# EAGLE design Papa_Soundie_doublesided (EAGLE 7.7.0)

## Sheet 1 of 2
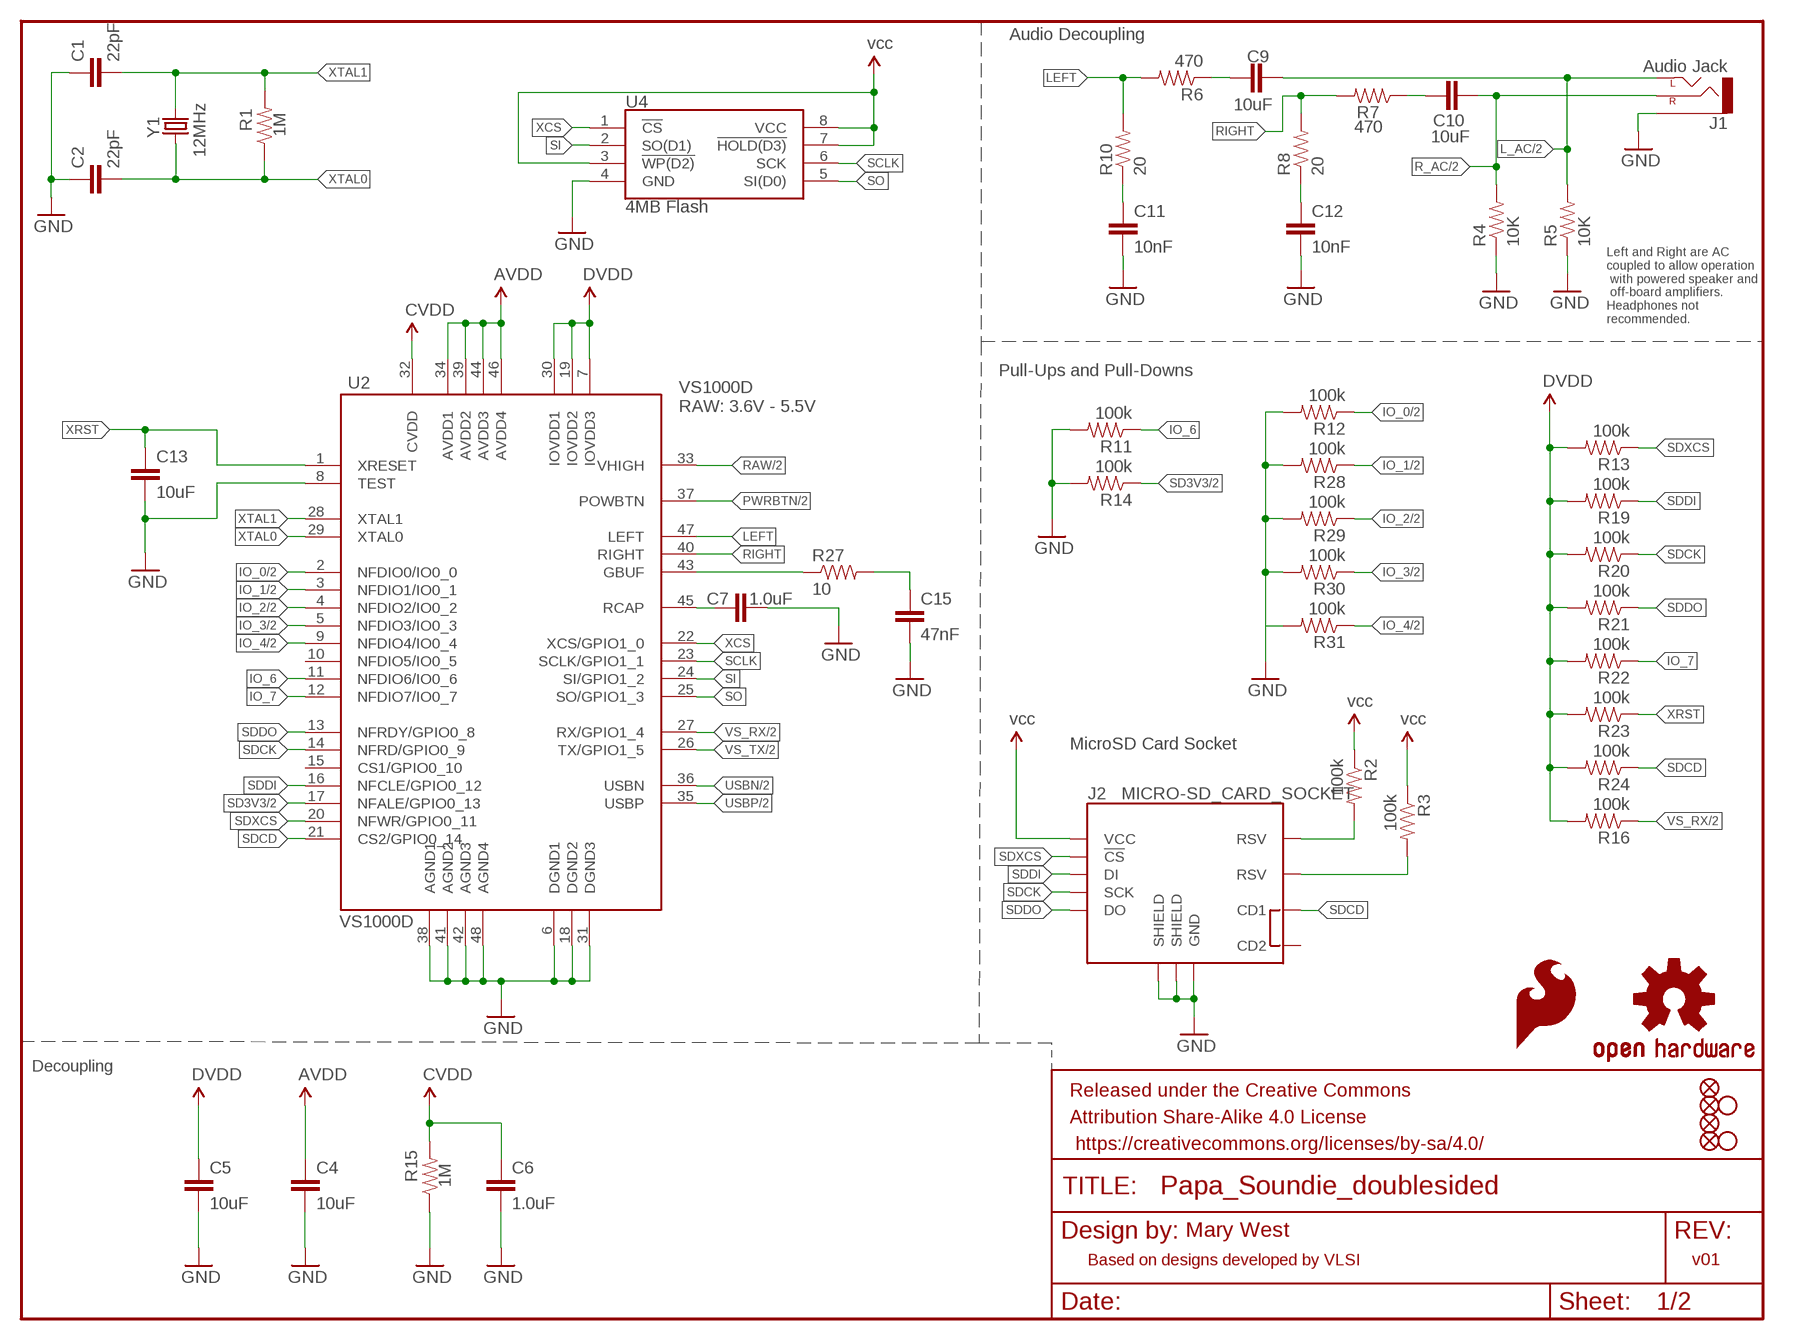
[diagram p0: schematic, sheet 1]

### Parts
C1  22pF  22PF-50V-5%(0603)  [0603-CAP]
C2  22pF  22PF-50V-5%(0603)  [0603-CAP]
C4  10uF  10UF-0603-6.3V-20%  [0603]
C5  10uF  10UF-0603-6.3V-20%  [0603]
C6  1.0uF  1.0UF-16V-10%(0603)  [0603-CAP]
C7  1.0uF  1.0UF-16V-10%(0603)  [0603-CAP]
C9  10uF  10UF-6.3V-20%(0603)  [0603-CAP]
C10  10uF  10UF-6.3V-20%(0603)  [0603-CAP]
C11  10nF  10NF/10000PF-50V-10%(0603)  [0603-CAP]
C12  10nF  10NF/10000PF-50V-10%(0603)  [0603-CAP]
C13  10uF  10UF-6.3V-20%(0603)  [0603-CAP]
C15  47nF  47NF(0.047UF/47000PF)-25V-5%(0603)SMD  [0603-CAP]
FD1  FIDUCIALUFIDUCIAL  [FIDUCIAL-MICRO]
FD2  FIDUCIALUFIDUCIAL  [FIDUCIAL-MICRO]
FD3  FIDUCIALUFIDUCIAL  [FIDUCIAL-MICRO]
FD4  FIDUCIALUFIDUCIAL  [FIDUCIAL-MICRO]
FRAME1  FRAME-LETTER  [CREATIVE_COMMONS]
H1  STAND-OFFTIGHT  [STAND-OFF-TIGHT]
H2  STAND-OFFTIGHT  [STAND-OFF-TIGHT]
J1  Audio Jack  AUDIO-JACKSMD2  [AUDIO-JACK-3.5MM-SMD]
J2  MICRO-SD_CARD_SOCKET  [MICRO-SD-SOCKET]
LOGO1  OSHW-LOGOL  [OSHW-LOGO-L]
LOGO2  SFE_LOGO_FLAME.2_INCH  [SFE_LOGO_FLAME_.2]
R1  1M  1MOHM-1/10W-1%(0603)  [0603-RES]
R2  100k  100KOHM-1/10W-1%(0603)  [0603-RES]
R3  100k  100KOHM-1/10W-1%(0603)  [0603-RES]
R4  10K  10KOHM-1/10W-1%(0603)0603  [0603-RES]
R5  10K  10KOHM-1/10W-1%(0603)0603  [0603-RES]
R6  470  470OHM1/10W1%(0603)  [0603-RES]
R7  470  470OHM1/10W1%(0603)  [0603-RES]
R8  20  20OHM1/10W1%(0603)SMD  [0603-RES]
R10  20  20OHM1/10W1%(0603)SMD  [0603-RES]
R11  100k  100KOHM-1/10W-1%(0603)  [0603-RES]
R12  100k  100KOHM-1/10W-1%(0603)  [0603-RES]
R13  100k  100KOHM-1/10W-1%(0603)  [0603-RES]
R14  100k  100KOHM-1/10W-1%(0603)  [0603-RES]
R15  1M  1MOHM-1/10W-1%(0603)  [0603-RES]
R16  100k  100KOHM-1/10W-1%(0603)  [0603-RES]
R19  100k  100KOHM-1/10W-1%(0603)  [0603-RES]
R20  100k  100KOHM-1/10W-1%(0603)  [0603-RES]
R21  100k  100KOHM-1/10W-1%(0603)  [0603-RES]
R22  100k  100KOHM-1/10W-1%(0603)  [0603-RES]
R23  100k  100KOHM-1/10W-1%(0603)  [0603-RES]
R24  100k  100KOHM-1/10W-1%(0603)  [0603-RES]
R27  10  10OHM-1/10W-5%0603SMD  [0603-RES]
R28  100k  100KOHM-1/10W-1%(0603)  [0603-RES]
R29  100k  100KOHM-1/10W-1%(0603)  [0603-RES]
R30  100k  100KOHM-1/10W-1%(0603)  [0603-RES]
R31  100k  100KOHM-1/10W-1%(0603)  [0603-RES]
U2  VS1000D  VS1000  [LQFP-48]
U4  4MB Flash  AT25SF041  [SO08]
Y1  12MHz  CRYSTALCRYSTAL-SMD-5X3-12MHZ  [CRYSTAL-SMD-5X3]

### Nets
AVDD: U2.34(AVDD1) U2.39(AVDD2) U2.44(AVDD3) U2.46(AVDD4)
CVDD: C6.1 R15.2 U2.32(CVDD)
DVDD: C5.1 R13.2 R16.2 R19.2 R20.2 R21.2 R22.2 R23.2 R24.2 U2.7(IOVDD3) U2.19(IOVDD2) U2.30(IOVDD1)
GBUF: R27.1 U2.43(GBUF)
GND: C1.1 C2.1 C4.2 C5.2 C6.2 C7.2 C11.2 C12.2 C13.2 C15.2 J1.SLEEVE J2.GND J2.GND1(SHIELD) J2.GND3(SHIELD) R4.1 R5.1 R11.2 R12.2 R14.2 R15.1 R28.2 R29.2 R30.2 R31.2 U2.6(DGND1) U2.8(TEST) U2.18(DGND2) U2.31(DGND3) U2.38(AGND1) U2.41(AGND2) U2.42(AGND3) U2.48(AGND4) U4.4(GND) ; also sheet 2
IO_0: R12.1 U2.2(NFDIO0/IO0_0) ; also sheet 2
IO_1: R28.1 U2.3(NFDIO1/IO0_1) ; also sheet 2
IO_2: R29.1 U2.4(NFDIO2/IO0_2) ; also sheet 2
IO_3: R30.1 U2.5(NFDIO3/IO0_3) ; also sheet 2
IO_4: R31.1 U2.9(NFDIO4/IO0_4) ; also sheet 2
IO_6: R11.1 U2.11(NFDIO6/IO0_6)
IO_7: R22.1 U2.12(NFDIO7/IO0_7)
L_AC: C9.2 J1.TIP(LEFT) R5.2 ; also sheet 2
LEFT: R6.2 R10.2 U2.47(LEFT)
N$2: C15.1 R27.2
N$3: C9.1 R6.1
N$6: C11.1 R10.1
N$7: C7.1 U2.45(RCAP)
N$15: J2.RSV1(RSV) R2.2
N$17: C10.1 R7.1
N$19: J2.RSV2(RSV) R3.2
N$20: C12.1 R8.1
PWRBTN: U2.37(POWBTN) ; also sheet 2
R_AC: C10.2 J1.RING(RIGHT) R4.2 ; also sheet 2
RAW: U2.33(VHIGH) ; also sheet 2
RIGHT: R7.2 R8.2 U2.40(RIGHT)
SCLK: U2.23(SCLK/GPIO1_1) U4.6(SCK)
SD3V3: R14.1 U2.17(NFALE/GPIO0_13) ; also sheet 2
SDCD: J2.CD1 R24.1 U2.21(CS2/GPIO0_14)
SDCK: J2.SCLK(SCK) R20.1 U2.14(NFRD/GPIO0_9)
SDDI: J2.DI R19.1 U2.16(NFCLE/GPIO0_12)
SDDO: J2.DO R21.1 U2.13(NFRDY/GPIO0_8)
SDXCS: J2.CS(!CS) R13.1 U2.20(NFWR/GPIO0_11)
SI: U2.24(SI/GPIO1_2) U4.2(SO(D1))
SO: U2.25(SO/GPIO1_3) U4.5(SI(D0))
USBN: U2.36(USBN) ; also sheet 2
USBP: U2.35(USBP) ; also sheet 2
VCC: C4.1 J2.VCC R2.1 R3.1 U4.3(!WP(D2)) U4.7(!HOLD(D3)) U4.8(VCC) ; supply symbol labelled vcc, AVDD ; also sheet 2
VS_RX: R16.1 U2.27(RX/GPIO1_4) ; also sheet 2
VS_TX: U2.26(TX/GPIO1_5) ; also sheet 2
XCS: U2.22(XCS/GPIO1_0) U4.1(!CS)
XRST: C13.1 R23.1 U2.1(XRESET)
XTAL0: C2.2 R1.1 U2.29(XTAL0) Y1.1
XTAL1: C1.2 R1.2 U2.28(XTAL1) Y1.3
Unconnected: J2.CD2 U2.10(NFDIO5/IO0_5) U2.15(CS1/GPIO0_10)

### Notes on the sheet
- Audio Decoupling
- Left and Right are AC
  coupled to allow operation
   with powered speaker and
   off-board amplifiers.
  Headphones not 
  recommended.
- Pull-Ups and Pull-Downs
- VS1000D 
  RAW: 3.6V - 5.5V
- MicroSD Card Socket
- Decoupling
- Mary West
- Based on designs developed by VLSI | v01

## Sheet 2 of 2
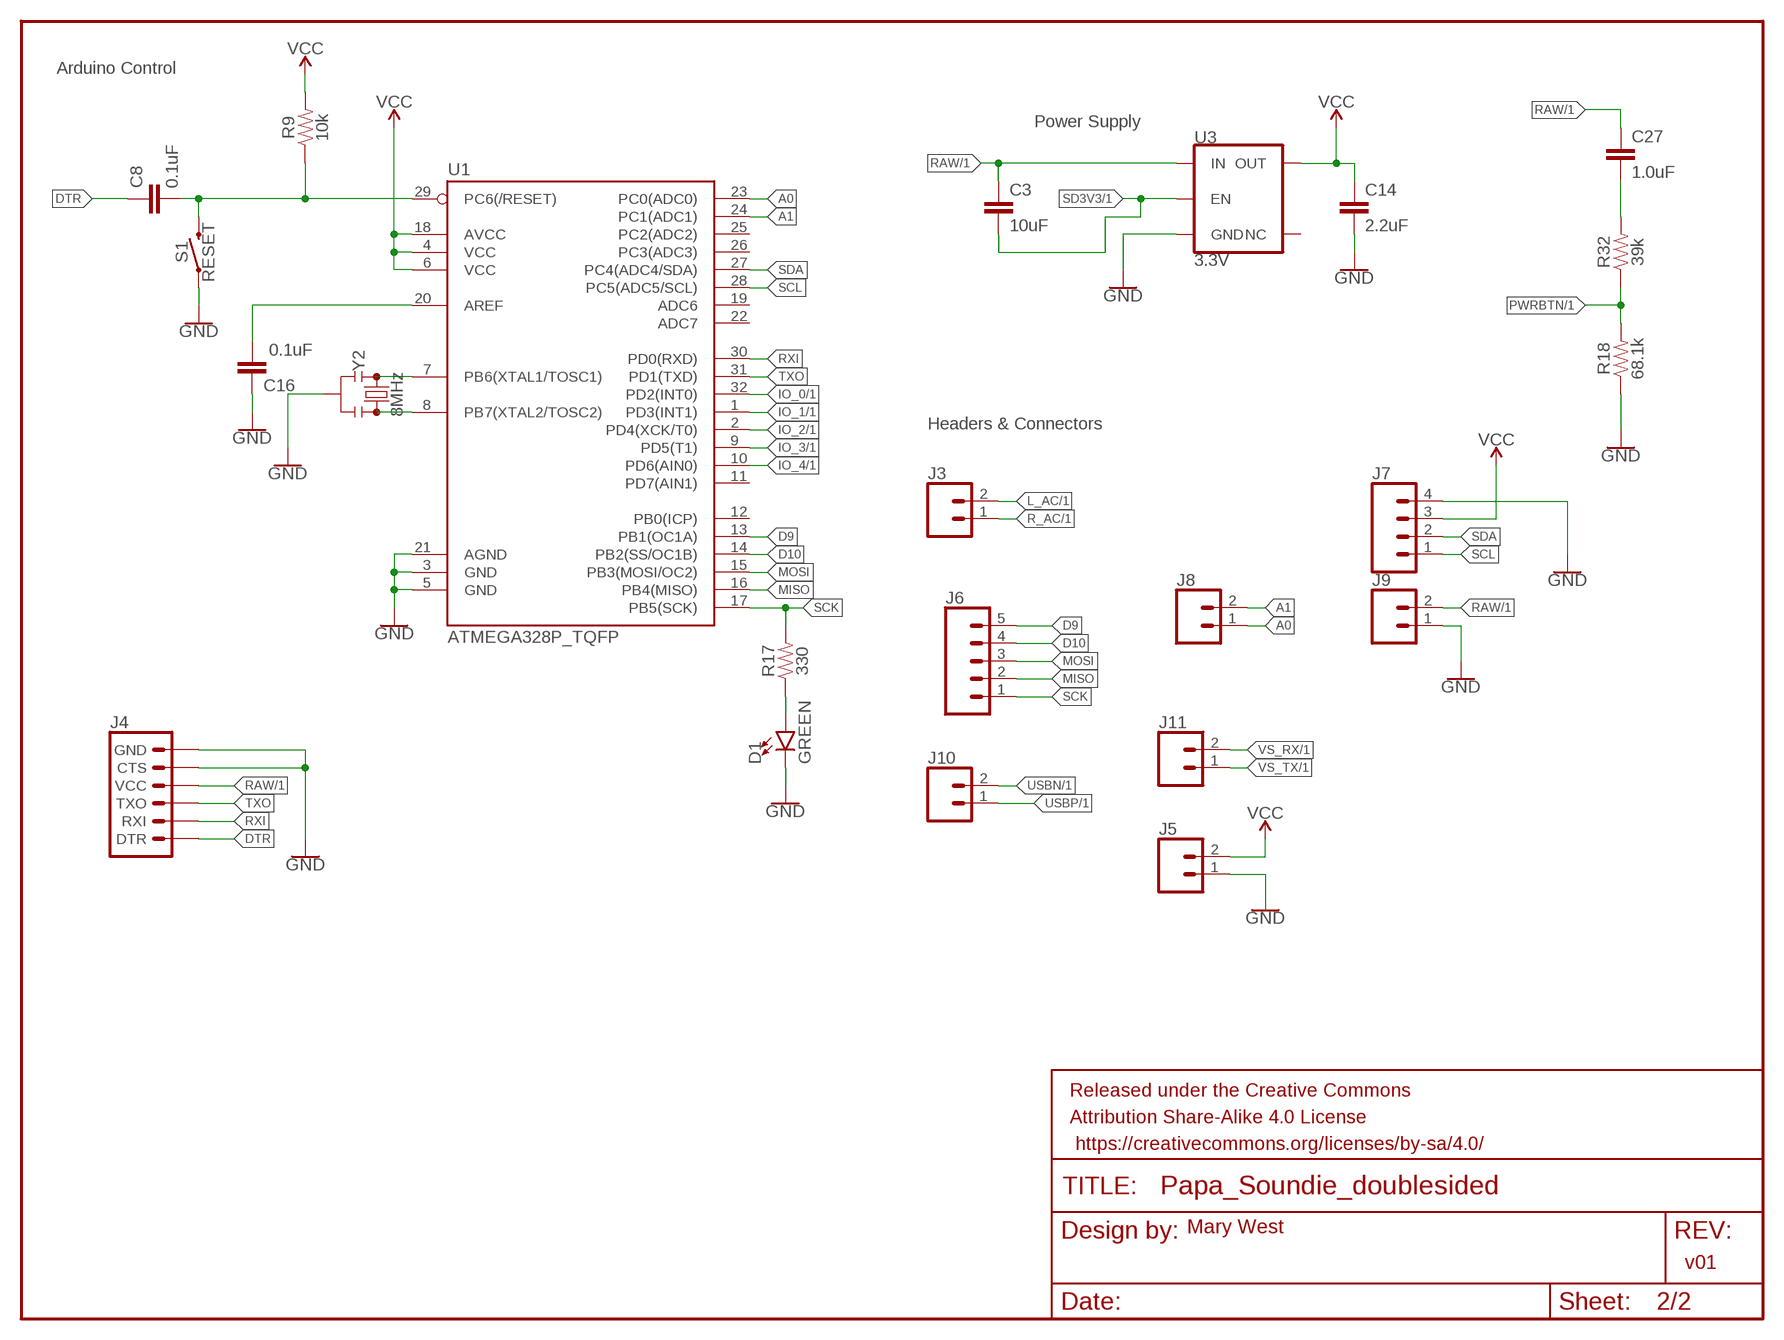
[diagram p1: schematic, sheet 2]

### Parts
C3  10uF  10UF-0603-6.3V-20%  [0603]
C8  0.1uF  0.1UF-0603-25V-(+80/-20%)  [0603]
C14  2.2uF  2.2UF-0603-10V-20%  [0603]
C16  0.1uF  0.1UF-0603-25V-(+80/-20%)  [0603]
C27  1.0uF  1.0UF-0603-16V-10%  [0603]
D1  GREEN  LED-GREEN0603  [LED-0603]
FRAME2  FRAME-LETTER  [CREATIVE_COMMONS]
J3  CONN_02  [1X02]
J4  6_PIN_SERIAL_TARGETSILK  [6_PIN_SERIAL_TARGET_SIDE_W_SILK]
J5  CONN_02  [1X02]
J6  CONN_05  [1X05]
J7  CONN_04  [1X04]
J8  CONN_02  [1X02]
J9  CONN_02  [1X02]
J10  CONN_02  [1X02]
J11  CONN_02  [1X02]
R9  10k  10KOHM-0603-1/10W-1%  [0603]
R17  330  330OHM-0603-1/10W-1%  [0603]
R18  68.1k  68.1KOHM-0603-1/10W-1%  [0603]
R32  39k  39KOHM-0603-1/10W-1%  [0603]
S1  RESET  MOMENTARY-SWITCH-SPST-SMD-5.2MM  [TACTILE_SWITCH_SMD_5.2MM]
U1  ATMEGA328P_TQFP  [TQFP32-08]
U3  3.3V  V_REG_AP2112K-3.3V  [SOT23-5]
Y2  8MHz  RESONATOR-8MHZSMD_3.2X1.3  [RESONATOR-SMD-3.2X1.3]

### Nets
A0: J8.1 U1.23(PC0(ADC0))
A1: J8.2 U1.24(PC1(ADC1))
D9: J6.5 U1.13(PB1(OC1A))
D10: J6.4 U1.14(PB2(SS/OC1B))
DTR: C8.1 J4.P$1(DTR)
GND: C14.2 C16.1 D1.C J4.P$5(CTS) J4.P$6(GND) J5.1 J7.4 J9.1 R18.1 S1.1 U1.3(GND) U1.5(GND) U1.21(AGND) U3.2(GND) Y2.2 ; also sheet 1
IO_0: U1.32(PD2(INT0)) ; also sheet 1
IO_1: U1.1(PD3(INT1)) ; also sheet 1
IO_2: U1.2(PD4(XCK/T0)) ; also sheet 1
IO_3: U1.9(PD5(T1)) ; also sheet 1
IO_4: U1.10(PD6(AIN0)) ; also sheet 1
L_AC: J3.2 ; also sheet 1
MISO: J6.2 U1.16(PB4(MISO))
MOSI: J6.3 U1.15(PB3(MOSI/OC2))
N$8: U1.7(PB6(XTAL1/TOSC1)) Y2.1
N$16: U1.8(PB7(XTAL2/TOSC2)) Y2.3
N$31: C8.2 R9.1 S1.3 U1.29(PC6(/RESET))
N$39: C16.2 U1.20(AREF)
N$42: D1.A R17.1
N$60: C27.2 R32.2
PWRBTN: R18.2 R32.1 ; also sheet 1
R_AC: J3.1 ; also sheet 1
RAW: C3.1 C27.1 J4.P$4(VCC) J9.2 U3.1(IN) ; also sheet 1
RXI: J4.P$3(RXI) U1.30(PD0(RXD))
SCK: J6.1 R17.2 U1.17(PB5(SCK))
SCL: J7.1 U1.28(PC5(ADC5/SCL))
SD3V3: C3.2 U3.3(EN) ; also sheet 1
SDA: J7.2 U1.27(PC4(ADC4/SDA))
TXO: J4.P$2(TXO) U1.31(PD1(TXD))
USBN: J10.2 ; also sheet 1
USBP: J10.1 ; also sheet 1
VCC: C14.1 J5.2 J7.3 R9.2 U1.4(VCC) U1.6(VCC) U1.18(AVCC) U3.5(OUT) ; also sheet 1
VS_RX: J11.2 ; also sheet 1
VS_TX: J11.1 ; also sheet 1
Unconnected: U1.11(PD7(AIN1)) U1.12(PB0(ICP)) U1.19(ADC6) U1.22(ADC7) U1.25(PC2(ADC2)) U1.26(PC3(ADC3)) U3.4(NC)

### Notes on the sheet
- Arduino Control
- Power Supply
- Headers & Connectors
- Mary West
- v01

## Library data of the parts
C1 C2 = SparkFun-Capacitors:22PF-50V-5%(0603): CAP-07876; PROD_ID: CAP-07876
C3-C5 = SparkFun-Capacitors:10UF: 10.0µF ceramic capacitors A capacitor is a passive two-terminal electrical component used to store electrical energy temporarily in an electric field.; PROD_ID: CAP-11015
C6 C7 = SparkFun-Capacitors:1.0UF-16V-10%(0603): CAP-00868; PROD_ID: CAP-00868
C8 C16 = SparkFun-Capacitors:0.1UF: 0.1µF ceramic capacitors A capacitor is a passive two-terminal electrical component used to store electrical energy temporarily in an electric field.; PROD_ID: CAP-00810
C9 C10 C13 = SparkFun-Capacitors:10UF-6.3V-20%(0603): CAP-11015; PROD_ID: CAP-11015
C11 C12 = SparkFun-Capacitors:10NF/10000PF-50V-10%(0603): CAP-00867; PROD_ID: CAP-00867
C14 = SparkFun-Capacitors:2.2UF: 2.2µF ceramic capacitors A capacitor is a passive two-terminal electrical component used to store electrical energy temporarily in an electric field.; PROD_ID: CAP-07888
C15 = SparkFun-Capacitors:47NF(0.047UF/47000PF)-25V-5%(0603): CAP-08605; PROD_ID: CAP-08605
C27 = SparkFun-Capacitors:1.0UF: 1µF ceramic capacitors A capacitor is a passive two-terminal electrical component used to store electrical energy temporarily in an electric field.; PROD_ID: CAP-00868
D1 = SparkFun-LED:LED-GREEN: Green SMD LED Used in manufacturing of various products at SparkFun Packages: 0603 - SMD 0603 package [Product Link] <http://www.futureelectronics.com/en/technologies/semiconductors/optoelectronics/leds/Pages/9894312-LTST-C190GKT.aspx?CrossPart=HSMG-C190&IM=0> LilyPad 1206 - SMD1206 LilyPad package [Product Link] <http://www.futureelectronics.com/en/Technologies/Product.aspx?ProductID=IN150NGHARVATEKCORPORATION2049943&IM=0> 1206 - SMD1206 package [Product Link] <http://www.futureelectronics.com/en/technologies/semiconductors/optoelectronics/leds/Pages/8315665-LTST-C150KGKT.aspx?IM=0> 1206 Bottom Mount -SMD 1206 Bottom Mount [Product Link] <http://www.digikey.com/product-detail/en/lite-on-inc/LTST-C230KGKT/160-1456-1-ND/386854> SparkFun Products: Pro Mini 328 -5V <https://www.sparkfun.com/products/821> RedBoard <https://www.sparkfun.com/products/12757> MP3 Trigger <https://www.sparkfun.com/products/13720> Makey Makey <https://www.sparkfun.com/products/11076>; PROD_ID: DIO-00821
FD1-FD4 = SparkFun-Aesthetics:FIDUCIAL: Fiducial Alignment Points Point-of-reference for pick-and-place machines and other optical instruments.
FRAME1 FRAME2 = SparkFun-Aesthetics:FRAME-LETTER: Schematic Frame - Letter Standard 8.5x11 US Letter frame
H1 H2 = SparkFun-Electromechanical:STAND-OFF: #4 Stand Off This is the mechanical footprint for a #4 phillips button head screw. Use the keepout ring to avoid running the screw head into surrounding components. SKU : PRT-00447
J1 = SparkFun-Connectors:AUDIO-JACK: 3.5mm Audio Jack Simple 3.5mm common PCB mount audio jack. Variant PTH is our storefront SKU PRT-08032; PROD_ID: CONN-10353
J2 = SparkFun-Connectors:MICRO-SD_CARD_SOCKET: microSD Socket for Transflash Push-push type µSD socket. tDoc lines correctly indicate media card edge positions when inserting (unlocked, locked, depressed). NOTE: CD1 and CD2 are connected internally, and the default detect state of the socket is detect pin to ground. SparkFun Products: WAV Trigger <https://www.sparkfun.com/products/13660> CAN-Bus Shield <https://www.sparkfun.com/products/13262> SparkFun Level Shifing microSD Breakout <https://www.sparkfun.com/products/13743>; PROD_ID: CONN-07820; SF_ID: PRT-00127
J3 J5 J8-J11 = SparkFun-Connectors:CONN_02: Multi connection point. Often used as Generic Header-pin footprint for 0.1 inch spaced/style header connections On any of the 0.1 inch spaced packages, you can populate with these: Break Away Headers - Straight <https://www.sparkfun.com/products/116> (PRT-00116) Break Away Male Headers - Right Angle <https://www.sparkfun.com/products/553> (PRT-00553) Female Headers <https://www.sparkfun.com/products/115> (PRT-00115) Break Away Headers - Machine Pin <https://www.sparkfun.com/products/117> (PRT-00117) Break Away Female Headers - Swiss Machine Pin <https://www.sparkfun.com/products/743> (PRT-00743) For SCREWTERMINALS and SPRING TERMINALS visit here: Screw Terimnals on SparkFun.com <https://www.sparkfun.com/search/results?term=Screw+Terminals> (5mm/3.5mm/2.54mm spacing) This device is also useful as a general connection point to wire up your design to another part of your project. Our various solder wires solder well into these plated through hole pads. Hook-Up Wire - Assortment (Stranded, 22 AWG) <https://www.sparkfun.com/products/11375> (PRT-11375) Hook-Up Wire - Assortment (Solid Core, 22 AWG) <https://www.sparkfun.com/products/11367> (PRT-11367) View the entire wire category on our website here <https://www.sparkfun.com/categories/141> Special notes: Molex polarized connector foot print use with: PRT-08233 with associated crimp pins and housings. 2.54_SCREWTERM for use with PRT-10571. 3.5mm Screw Terminal footprints for PRT-08084 5mm Screw Terminal footprints for use with PRT-08432
J4 = SparkFun-Connectors:6_PIN_SERIAL_TARGET: 6-pin header connection for use with the "FTDI BASIC" pinout - TARGET SIDE. Also known as "Arduino Serial Program Header". It is used to mate with our FTDI Basic serial programmers using the Arduino IDE. Note, this device has "TARGET" in the name. It is intended to be used on a design that contains a target micro-controller that you wish to program. The "sister" device, named "CABLE" is inteneded to be used on a design that usually lives on the end of your USB cable and prvides the converter chip (FTDI232 or FTDI231x) to commnicate serial RX/TX. You can populate with some of these: Break Away Headers - Straight <https://www.sparkfun.com/products/116> (PRT-00116) For reference (or to suit your programming needs) check out these designs: SparkFun FTDI Basic Breakout - 5V <https://www.sparkfun.com/products/9716> (DEV-09716) SparkFun FTDI Basic Breakout - 3.3V <https://www.sparkfun.com/products/9873> (DEV-09873) SparkFun FTDI SmartBasic <https://www.sparkfun.com/products/12935> (DEV-12935) SparkFun Beefy 3 - FTDI Basic Breakout <https://www.sparkfun.com/products/13746> (DEV-13746)
J6 = SparkFun-Connectors:CONN_05: Multi connection point. Often used as Generic Header-pin footprint for 0.1 inch spaced/style header connections On any of the 0.1 inch spaced packages, you can populate with these: Break Away Headers - Straight <https://www.sparkfun.com/products/116> (PRT-00116) Break Away Male Headers - Right Angle <https://www.sparkfun.com/products/553> (PRT-00553) Female Headers <https://www.sparkfun.com/products/115> (PRT-00115) Break Away Headers - Machine Pin <https://www.sparkfun.com/products/117> (PRT-00117) Break Away Female Headers - Swiss Machine Pin <https://www.sparkfun.com/products/743> (PRT-00743) For SCREWTERMINALS and SPRING TERMINALS visit here: Screw Terimnals on SparkFun.com <https://www.sparkfun.com/search/results?term=Screw+Terminals> (5mm/3.5mm/2.54mm spacing) This device is also useful as a general connection point to wire up your design to another part of your project. Our various solder wires solder well into these plated through hole pads. Hook-Up Wire - Assortment (Stranded, 22 AWG) <https://www.sparkfun.com/products/11375> (PRT-11375) Hook-Up Wire - Assortment (Solid Core, 22 AWG) <https://www.sparkfun.com/products/11367> (PRT-11367) View the entire wire category on our website here <https://www.sparkfun.com/categories/141> Special notes: Molex polarized connector foot print use with SKU : PRT-08231 with associated crimp pins and housings. 1MM SMD Version SKU: PRT-10208
J7 = SparkFun-Connectors:CONN_04: Multi connection point. Often used as Generic Header-pin footprint for 0.1 inch spaced/style header connections On any of the 0.1 inch spaced packages, you can populate with these: Break Away Headers - Straight <https://www.sparkfun.com/products/116> (PRT-00116) Break Away Male Headers - Right Angle <https://www.sparkfun.com/products/553> (PRT-00553) Female Headers <https://www.sparkfun.com/products/115> (PRT-00115) Break Away Headers - Machine Pin <https://www.sparkfun.com/products/117> (PRT-00117) Break Away Female Headers - Swiss Machine Pin <https://www.sparkfun.com/products/743> (PRT-00743) For SCREWTERMINALS and SPRING TERMINALS visit here: Screw Terimnals on SparkFun.com <https://www.sparkfun.com/search/results?term=Screw+Terminals> (5mm/3.5mm/2.54mm spacing) This device is also useful as a general connection point to wire up your design to another part of your project. Our various solder wires solder well into these plated through hole pads. Hook-Up Wire - Assortment (Stranded, 22 AWG) <https://www.sparkfun.com/products/11375> (PRT-11375) Hook-Up Wire - Assortment (Solid Core, 22 AWG) <https://www.sparkfun.com/products/11367> (PRT-11367) View the entire wire category on our website here <https://www.sparkfun.com/categories/141> Special notes: Molex polarized connector foot print use with SKU : PRT-08231 with associated crimp pins and housings. 1MM SMD Version SKU: PRT-10208; PROD_ID: CONN-09696
LOGO1 = SparkFun-Aesthetics:OSHW-LOGO: Open-Source Hardware (OSHW) Logo This logo indicates the piece of hardware it is found on incorporates a OSHW license and/or adheres to the definition of open source hardware found here: http://freedomdefined.org/OSHW
LOGO2 = SparkFun-Aesthetics:SFE_LOGO_FLAME: SparkFun Flame Logo This is the SparkFun flame logo. The logo on the schematic will always be the same size; the package variant is the height of the flame. Default layer for the logo on the board is tSilk.
R1 R15 = SparkFun-Resistors:1MOHM-1/10W-1%(0603): RES-07868; PROD_ID: RES-07868
R2 R3 R11-R14 R16 R19-R24 R28-R31 = SparkFun-Resistors:100KOHM-1/10W-1%(0603): RES-07828; PROD_ID: RES-07828
R4 R5 = SparkFun-Resistors:10KOHM-1/10W-1%(0603): RES-00824; PROD_ID: RES-00824
R6 R7 = SparkFun-Resistors:470OHM1/10W1%(0603): RES-07869; PROD_ID: RES-07869
R8 R10 = SparkFun-Resistors:20OHM1/10W1%(0603): RES-07862; PROD_ID: RES-07862
R9 = SparkFun-Resistors:10KOHM: 10kΩ resistor A resistor is a passive two-terminal electrical component that implements electrical resistance as a circuit element. Resistors act to reduce current flow, and, at the same time, act to lower voltage levels within circuits. - Wikipedia; PROD_ID: RES-00824
R17 = SparkFun-Resistors:330OHM: 330Ω resistor A resistor is a passive two-terminal electrical component that implements electrical resistance as a circuit element. Resistors act to reduce current flow, and, at the same time, act to lower voltage levels within circuits. - Wikipedia; PROD_ID: RES-00818
R18 = SparkFun-Resistors:68.1KOHM: 68.1kΩ resistor A resistor is a passive two-terminal electrical component that implements electrical resistance as a circuit element. Resistors act to reduce current flow, and, at the same time, act to lower voltage levels within circuits. - Wikipedia; PROD_ID: RES-09380
R27 = SparkFun-Resistors:10OHM-1/10W-5%0603: RES-09834; PROD_ID: RES-09834
R32 = SparkFun-Resistors:39KOHM: 39kΩ resistor A resistor is a passive two-terminal electrical component that implements electrical resistance as a circuit element. Resistors act to reduce current flow, and, at the same time, act to lower voltage levels within circuits. - Wikipedia; PROD_ID: RES-12377
S1 = SparkFun-Switches:MOMENTARY-SWITCH-SPST: Momentary Switch (Pushbutton) - SPST Normally-open (NO) SPST momentary switches (buttons, pushbuttons). Variants PTH-12MM - 12mm square, through-hole Momentary Pushbutton Switch - 12mm Square <https://www.sparkfun.com/products/9190> (COM-09190) PTH-6.0MM, PTH-6.0MM-KIT - 6.0mm square, through-hole Mini Pushbutton Switch <https://www.sparkfun.com/products/97> (COM-00097) KIT package intended for soldering kit's - only one side of pads' copper is exposed. PTH-RIGHT-ANGLE-KIT - Right-angle, through-hole Right Angle Tactile Button <https://www.sparkfun.com/products/10791> - Used on SparkFun BigTime Watch Kit <https://www.sparkfun.com/products/11734> SMD-12MM - 12mm square, surface-mount Tactile Button - SMD (12mm) <https://www.sparkfun.com/products/12993> (COM-12993) Used on SparkFun PicoBoard <https://www.sparkfun.com/products/11888> SMD-4.5MM - 4.5mm Square Trackball Switch Used on SparkFun Blackberry Trackballer Breakout <https://www.sparkfun.com/products/13169> SMD-4.6MMX2.8MM - 4.60mm x 2.80mm, surface mount Used on SparkFun SAMD21 Mini Breakout <https://www.sparkfun.com/products/13664> SMD-5.2MM, SMD-5.2-REDUNDANT - 5.2mm square, surface-mount Mini Pushbutton Switch - SMD <https://www.sparkfun.com/products/8720> (COM-08720) Used on Arduino Pro Mini <https://www.sparkfun.com/products/11114> REDUNDANT package connects both switch circuits together SMD-6.0X3.5MM - 6.0 x 3.5mm, surface mount Momentary Reset Switch SMD <https://www.sparkfun.com/products/8229> (COM-08229) SMD-6.2MM-TALL - 6.2mm square, surface mount Tactile Button - SMD (6mm) <https://www.sparkfun.com/products/12992> Used on SparkFun Digital Sandbox <https://www.sparkfun.com/products/12651> SMD-RIGHT-ANGLE - Right-angle, surface mount Used on SparkFun Block for Intel® Edison - Arduino <https://www.sparkfun.com/products/13036>; PROD_ID: SWCH-08247; SF_SKU: COM-08720
U1 = SparkFun-IC-Microcontroller:ATMEGA328P_TQFP: Popular 328P in QFP Storefront component: ATmega328 - TQFP <https://www.sparkfun.com/products/13448> (COM-13448) Datasheet <http://www.sparkfun.com/datasheets/Components/SMD/ATMega328.pdf> SparkFun Products SparkFun RedBoard - Programmed with Arduino <https://www.sparkfun.com/products/12757> (DEV-12757) Arduino Pro Mini 328 - 5V/16MHz <https://www.sparkfun.com/products/11113> (DEV-11113) Arduino Pro Mini 328 - 3.3V/8MHz <https://www.sparkfun.com/products/11114> (DEV-11114) SparkFun OpenLog <https://www.sparkfun.com/products/13712> (DEV-13712) SparkFun MicroView - OLED Arduino Module <https://www.sparkfun.com/products/12923> (DEV-12923) SparkFun Digital Sandbox <https://www.sparkfun.com/products/12651> (DEV-12651) SparkFun PicoBoard <https://www.sparkfun.com/products/11888> (WIG-11888) Arduino Fio <https://www.sparkfun.com/products/10116> (DEV-10116) LilyPad Arduino 328 Main Board <https://www.sparkfun.com/products/13342> (DEV-13342) SparkFun RedStick <https://www.sparkfun.com/products/13741> (DEV-13741) LilyPad MP3 <https://www.sparkfun.com/products/11013> (DEV-11013) LilyPad Arduino SimpleSnap <https://www.sparkfun.com/products/10941> (DEV-10941) SparkFun Stepoko <https://www.sparkfun.com/products/13899> (ROB-13899) SparkFun Geiger Counter <https://www.sparkfun.com/products/11345> (SEN-11345) SparkFun EL Sequencer <https://www.sparkfun.com/products/12781> (COM-12781) Arduino Pro 328 - 5V/16MHz <https://www.sparkfun.com/products/10915> (DEV-10915) CryptoCape <https://www.sparkfun.com/products/12773> (DEV-12773) SparkFun IR Thermometer Evaluation Board - MLX90614 <https://www.sparkfun.com/products/10740> (SEN-10740) SparkFun RedBot Mainboard <https://www.sparkfun.com/products/12097> (ROB-12097) Arduino Pro 328 - 3.3V/8MHz <https://www.sparkfun.com/products/10914> (DEV-10914) SparkFun Block for Intel® Edison - Arduino <https://www.sparkfun.com/products/13036> (DEV-13036) SparkFun Simon Says - Surface Mount Soldering Kit <https://www.sparkfun.com/products/10935> (KIT-10935) SparkFun 7-Segment Serial Display - Red <https://www.sparkfun.com/products/11441> (COM-11441) SparkFun 7-Segment Serial Display - White <https://www.sparkfun.com/products/11629> (COM-11629) SparkFun 7-Segment Serial Display - Yellow <https://www.sparkfun.com/products/11443> (COM-11443) SparkFun 7-Segment Serial Display - Kelly Green <https://www.sparkfun.com/products/11440> (COM-11440) SparkFun 7-Segment Serial Display - Blue <https://www.sparkfun.com/products/11442> (COM-11442) SparkFun OpenSegment Serial Display - 20mm (Blue) <https://www.sparkfun.com/products/11647> (COM-11647) SparkFun OpenSegment Serial Display - 20mm (Green) <https://www.sparkfun.com/products/11646> (COM-11646) SparkFun OpenSegment Serial Display - 20mm (White) <https://www.sparkfun.com/products/11648> (COM-11648) SparkFun OpenSegment Serial Display - 20mm (Red) <https://www.sparkfun.com/products/11644> (COM-11644) SparkFun OpenSegment Serial Display - 20mm (Yellow) <https://www.sparkfun.com/products/11645> (COM-11645) SparkFun OpenSegment Shield <https://www.sparkfun.com/products/13190> (DEV-13190); PROD_ID: IC-09069
U2 = SparkFun-IC-Conversion:VS1000: VS1000D Ogg Vorbis Player IC with USB and NAND FLASH Interface 12 MHz LQFP-48 Datasheet SparkFun Products Storefront component: Ogg Vorbis Codec IC - VS1000D <https://www.sparkfun.com/products/8300> (COM-08300); PROD_ID: LPA-12743
U3 = SparkFun-IC-Power:V_REG_AP2112: AP2112 - 600mA CMOS LDO Regulator w/ Enable The AP2112 is CMOS process low dropout linear regulator with enable function, the regulator delivers a guaranteed 600mA (min.) continuous load current. Features Output Voltage Accuracy: ±1.5% Output Current: 600mA (Min.) Foldback Short Current Protection: 50mA Enable Function to Turn ON/OFF VOUT Low Dropout Voltage (3.3V): 250mV (Typ.) @IOUT=600mA Excellent Load Regulation: 0.2%/A (Typ.) Excellent Line Regulation: 0.02%/V (Typ.) Low Quiescent Current: 55μA (Typ.) Low Standby Current: 0.01μA (Typ.) Low Output Noise: 50μVRMS PSRR: 100Hz -65dB, 1kHz -65dB OTSD Protection Stable with 1.0μF Flexible Cap: Ceramic, Tantalum and Aluminum Electrolytic Operation Temperature Range: -40°C to 85°C ESD: MM 400V, HBM 4000V; PROD_ID: VREG-12457
U4 = SparkFun-IC-Memory:AT25SF041: AT25SF041 4Mb Serial Flash Memory 104MHz, SPI, 8-SOIC Datasheet <http://www.adestotech.com/wp-content/uploads/DS-AT25SF041_044.pdf> SparkFun Products: SparkFun ESP8266 Thing <https://www.sparkfun.com/products/13231> SparkFun ESP8266 Thing - Dev Board <https://www.sparkfun.com/products/13711>; PROD_ID: IC-12455
Y1 = SparkFun-FreqCtrl:CRYSTAL: Various standard crystals. Proven footprints.; PROD_ID: XTAL-08297
Y2 = SparkFun-Clocks:RESONATOR-8MHZ: 8MHz Resonator Digikey Example <http://www.digikey.com/product-detail/en/murata-electronics-north-america/CSTCE10M0G55-R0/490-1196-1-ND/584633> Frequency: 8MHz Frequency Stability: ±0.2% Frequency Tolerance: ±0.5% Capacitance: 33pF SparkFun Products Arduino Pro Mini 328- 3.3V/8MHz <https://www.sparkfun.com/products/11114> SparkFun Digital Sandbox <https://www.sparkfun.com/products/12651>; PROD_ID: XTAL-08895

## Board
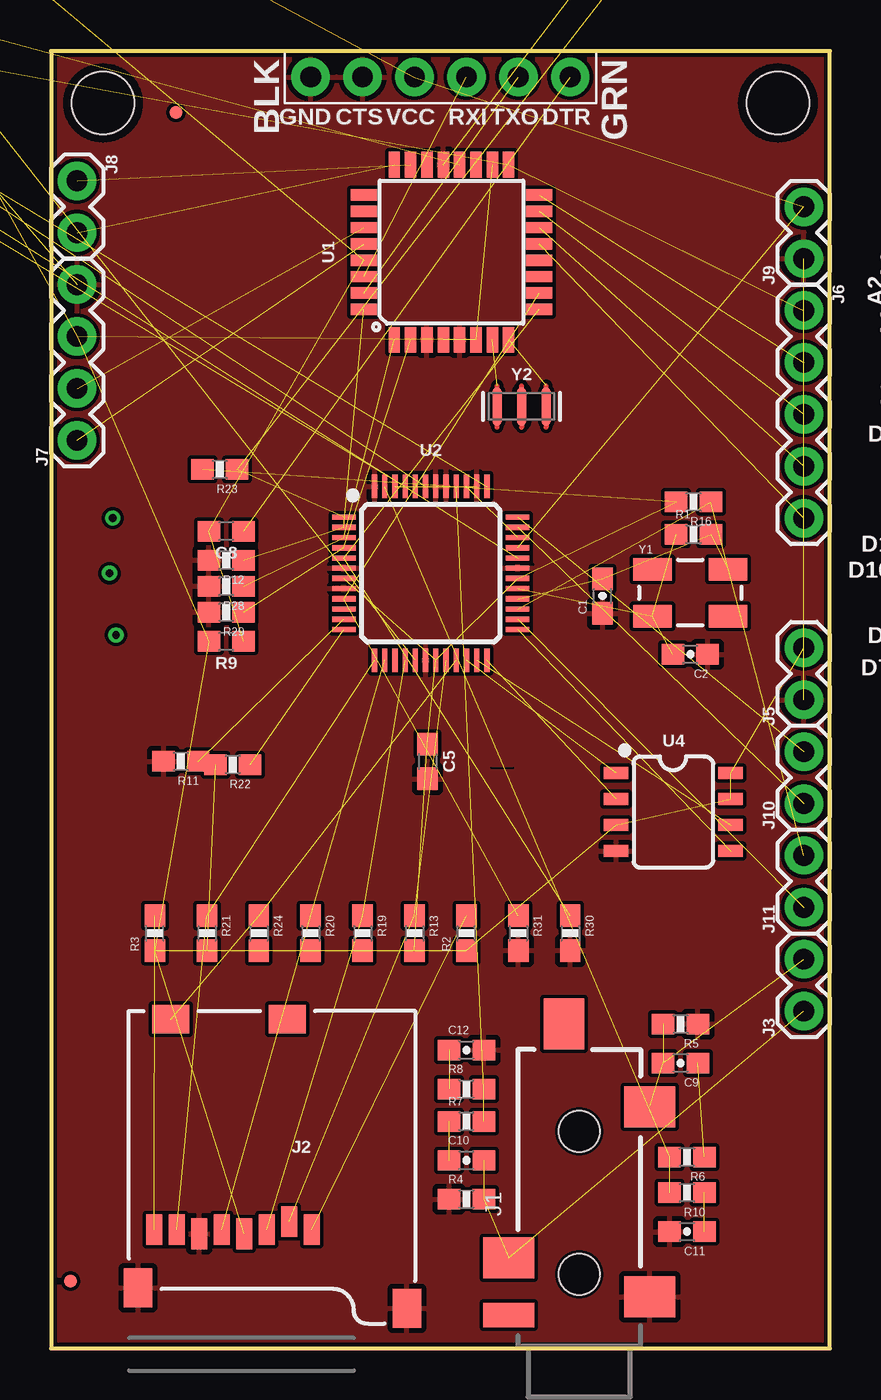
[diagram p2: board, top side]
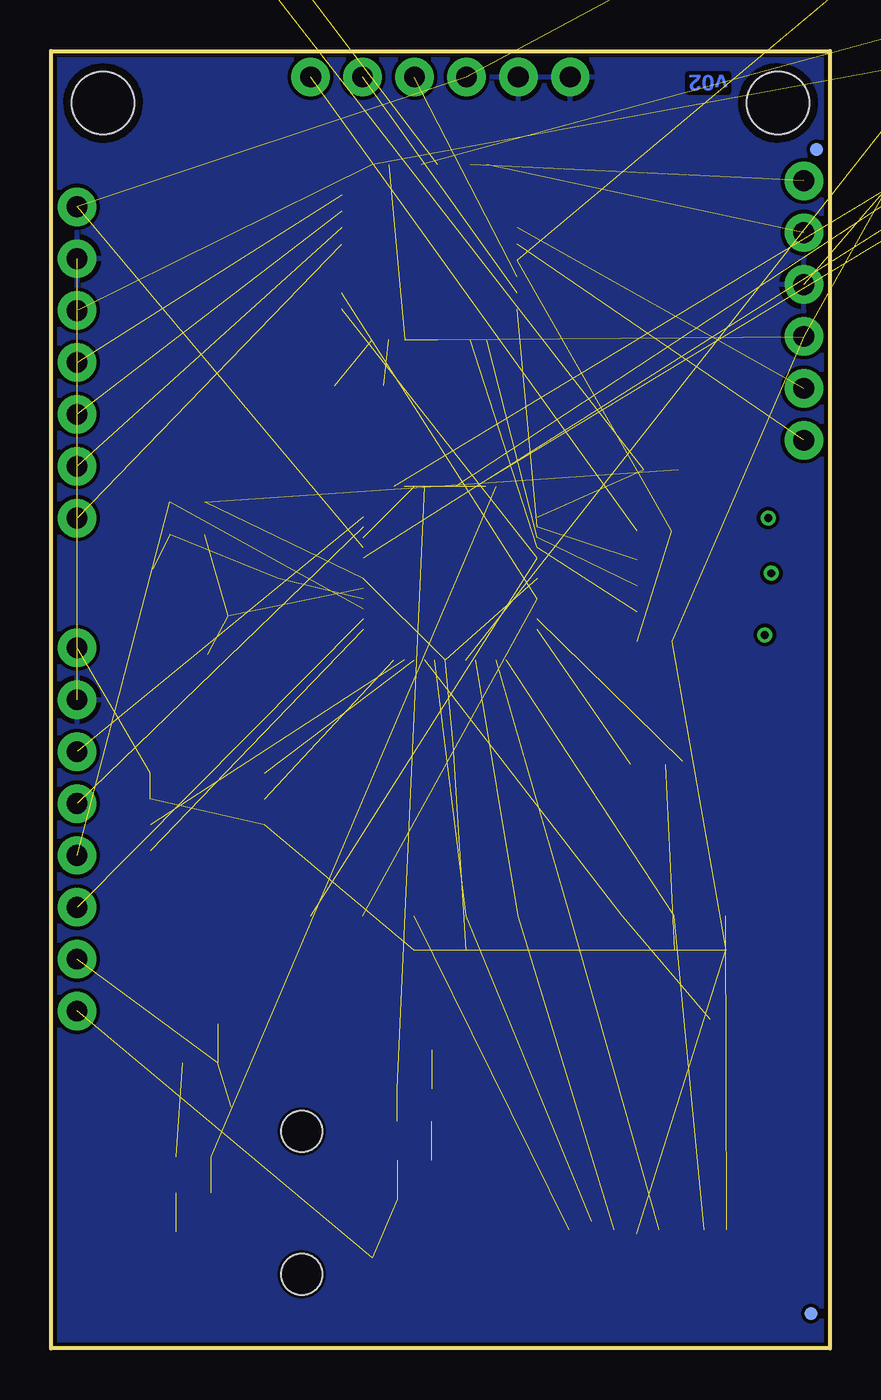
[diagram p3: board, bottom side, seen from below]

Size 38.1 x 63.5 mm. Coordinates in mm from the lower left corner, seen from the top.
Outline: 38.1,63.5 0,63.5 0,0 38.1,0 38.1,63.5
Copper layers (1*16): Top 0.035mm / dielectric 1.5mm / Bottom 0.035mm
Design rules "SparkFun-2-layer-TIGHT": minimum track width 7mil, minimum drill 15mil, track to track 7mil, track to pad 7mil, pad to pad 7mil, via to via 7mil, smd to smd 7mil, copper to edge 7mil, drill to drill 7mil, minimum pad ring 7mil, minimum via ring 7mil, stop-mask expansion 4mil, vias tented up to drill 25mil, thermal gap 10mil
tRestrict: 1 lines

### Footprints (pad centres in the part's own frame; a part is rotated, then mirrored left to right if it is on the bottom)
0603-CAP = smd 1.1 x 1: 1 -0.85,0; 2 0.85,0
0603 = smd 1.1 x 1: 1 -0.85,0; 2 0.85,0
LED-0603 = smd 1 x 1: A -0.877,0; C 0.877,0
FIDUCIAL-MICRO = smd 0.635 x 0.635: 1 0,0
STAND-OFF-TIGHT = hole 3.048: 0,0
AUDIO-JACK-3.5MM-SMD = smd 2 x 2.5: RING 4.3,3.45; SLEEVE 2.4,-3.45; TIP 11.7,-3.45 | smd 1.2 x 2.5: RSH 1.5,3.45 | smd 2.5 x 2: TSH 15.75,0.75 | hole 2: 3.5,0; 10.5,0
MICRO-SD-SOCKET = smd 1.8 x 1.4: CD1 -2.05,0.4; CD2 -7.75,0.4 | smd 0.8 x 1.5: CS -7.84,10.3; DI -6.74,10.7; DO -2.34,10.7; GND -3.44,10.9; RSV1 -8.94,10.7; RSV2 -1.24,10.7; SCLK -4.54,10.7; VCC -5.64,10.9 | smd 1.4 x 1.9: GND1 -13.6,14.55; GND3 -0.45,13.55
1X02 = drill 1.016 pad 1.88: 1 0,0; 2 2.54,0
6_PIN_SERIAL_TARGET_SIDE_W_SILK = drill 1.016 pad 1.88: P$1 -6.35,0; P$2 -3.81,0; P$3 -1.27,0; P$4 1.27,0; P$5 3.81,0; P$6 6.35,0
1X05 = drill 1.016 pad 1.88: 1 0,0; 2 2.54,0; 3 5.08,0; 4 7.62,0; 5 10.16,0
1X04 = drill 1.016 pad 1.88: 1 0,0; 2 2.54,0; 3 5.08,0; 4 7.62,0
0603-RES = smd 1.1 x 1: 1 -0.85,0; 2 0.85,0
TACTILE_SWITCH_SMD_5.2MM = smd 1.524 x 0.762: 1 -2.794,1.905; 2 2.794,1.905; 3 -2.794,-1.905; 4 2.794,-1.905
TQFP32-08 = smd 1.27 x 0.559: 1 -4.293,2.8; 2 -4.293,2; 3 -4.293,1.2; 4 -4.293,0.4; 5 -4.293,-0.4; 6 -4.293,-1.2; 7 -4.293,-2; 8 -4.293,-2.8; 17 4.293,-2.8; 18 4.293,-2; 19 4.293,-1.2; 20 4.293,-0.4; 21 4.293,0.4; 22 4.293,1.2; 23 4.293,2; 24 4.293,2.8 | smd 0.559 x 1.27: 9 -2.8,-4.293; 10 -2,-4.293; 11 -1.2,-4.293; 12 -0.4,-4.293; 13 0.4,-4.293; 14 1.2,-4.293; 15 2,-4.293; 16 2.8,-4.293; 25 2.8,4.293; 26 2,4.293; 27 1.2,4.293; 28 0.4,4.293; 29 -0.4,4.293; 30 -1.2,4.293; 31 -2,4.293; 32 -2.8,4.293
LQFP-48 = smd 0.254 x 1.143: 1 -2.75,-4.25; 2 -2.25,-4.25; 3 -1.75,-4.25; 4 -1.25,-4.25; 5 -0.75,-4.25; 6 -0.25,-4.25; 7 0.25,-4.25; 8 0.75,-4.25; 9 1.25,-4.25; 10 1.75,-4.25; 11 2.25,-4.25; 12 2.75,-4.25; 25 2.75,4.25; 26 2.25,4.25; 27 1.75,4.25; 28 1.25,4.25; 29 0.75,4.25; 30 0.25,4.25; 31 -0.25,4.25; 32 -0.75,4.25; 33 -1.25,4.25; 34 -1.75,4.25; 35 -2.25,4.25; 36 -2.75,4.25 | smd 1.143 x 0.254: 13 4.25,-2.75; 14 4.25,-2.25; 15 4.25,-1.75; 16 4.25,-1.25; 17 4.25,-0.75; 18 4.25,-0.25; 19 4.25,0.25; 20 4.25,0.75; 21 4.25,1.25; 22 4.25,1.75; 23 4.25,2.25; 24 4.25,2.75; 37 -4.25,2.75; 38 -4.25,2.25; 39 -4.25,1.75; 40 -4.25,1.25; 41 -4.25,0.75; 42 -4.25,0.25; 43 -4.25,-0.25; 44 -4.25,-0.75; 45 -4.25,-1.25; 46 -4.25,-1.75; 47 -4.25,-2.25; 48 -4.25,-2.75
SOT23-5 = smd 0.55 x 1.2: 1 -0.95,-1.3; 2 0,-1.3; 3 0.95,-1.3; 4 0.95,1.3; 5 -0.95,1.3
SO08 = smd 0.6 x 1.2: 1 -1.905,-2.8; 2 -0.635,-2.8; 3 0.635,-2.8; 4 1.905,-2.8; 5 1.905,2.8; 6 0.635,2.8; 7 -0.635,2.8; 8 -1.905,2.8
CRYSTAL-SMD-5X3 = smd 1.9 x 1.1: 1 -1.85,-1.15; 2 1.85,-1.15; 3 1.85,1.15; 4 -1.85,1.15
RESONATOR-SMD-3.2X1.3 = smd 0.45 x 1.905: 1 -1.2,0; 2 0,0; 3 1.2,0

### Placement (x,y rotation side)
C1  26.99,36.83 90 top
C2  31.27,33.97 180 top
C3  -23.65,78.11 90 top  (outside the outline)
C4  -12.22,72.87 270 top  (outside the outline)
C5  18.41,28.73 270 top
C6  -11.75,61.12 0 top  (outside the outline)
C7  -25.4,68.9 90 top  (outside the outline)
C8  8.57,40.01 180 top
C9  30.8,13.97 180 top
C10  20.32,9.21 0 top
C11  31.11,5.71 180 top
C12  20.32,14.61 0 top
C13  28.57,69.22 180 top  (outside the outline)
C14  -16.03,72.87 270 top  (outside the outline)
C15  -23.02,68.9 270 top  (outside the outline)
C16  -6.03,65.25 180 top  (outside the outline)
C27  -13.34,78.11 270 top  (outside the outline)
D1  -6.03,61.59 180 top  (outside the outline)
FD1  6.11,60.49 90 top
FD2  0.95,3.3 90 top
FD3  0.65,58.69 180 bottom
FD4  0.92,1.71 180 bottom
FRAME1  -15.08,-23.81 0 top  (outside the outline)
FRAME2  -15.08,-23.81 0 top  (outside the outline)
FRAME3  FRAME-LETTER  [CREATIVE_COMMONS]  -15.08,-23.81 0 top  (outside the outline)
H1  35.56,60.96 90 top
H2  2.54,60.96 180 top
J1  25.84,0.13 90 top
J2  3.81,16.51 180 top
J3  36.83,16.51 90 top
J4  19.05,62.23 180 top
J5  36.83,31.75 90 top
J6  36.83,50.8 270 top
J7  1.27,44.45 90 top
J8  1.27,57.15 270 top
J9  36.83,53.34 90 top
J10  36.83,26.67 90 top
J11  36.83,21.59 90 top
LOGO1  101.5,59.09 180 bottom  (outside the outline)
LOGO2  89.09,40.74 0 top  (outside the outline)
LOGO3  OSHW-LOGOL  [OSHW-LOGO-MINI]  59.79,12.35 0 top  (outside the outline)
LOGO6  SFE_LOGO_NAME_FLAME.1_INCH  [SFE_LOGO_NAME_FLAME_.2]  115.95,63.28 180 bottom  (outside the outline)
R1  31.43,39.85 0 top
R2  20.32,20.32 90 top
R3  5.08,20.32 90 top
R4  20.32,7.3 0 top
R5  30.8,15.88 180 top
R6  31.11,9.37 180 top
R7  20.32,11.11 0 top
R8  20.32,12.7 0 top
R9  8.57,34.61 180 top
R10  31.11,7.62 180 top
R11  6.35,28.73 180 top
R12  8.57,38.58 180 top
R13  17.78,20.32 270 top
R14  -20.95,78.11 270 top  (outside the outline)
R15  -11.75,63.02 180 top  (outside the outline)
R16  31.43,41.43 180 top
R17  -6.03,63.34 180 top  (outside the outline)
R18  -14.92,64.93 270 top  (outside the outline)
R19  15.24,20.32 270 top
R20  12.7,20.32 270 top
R21  7.62,20.32 270 top
R22  8.89,28.57 180 top
R23  8.26,43.02 180 top
R24  10.16,20.32 270 top
R27  -20.95,68.9 90 top  (outside the outline)
R28  8.57,37.31 180 top
R29  8.57,36.04 180 top
R30  25.4,20.32 270 top
R31  22.86,20.32 270 top
R32  -16.51,64.93 90 top  (outside the outline)
S1  -6.67,70.48 270 top  (outside the outline)
U1  19.59,53.66 90 top
U2  18.57,37.94 270 top
U3  -17.14,78.11 180 top  (outside the outline)
U4  30.45,26.26 270 top
Y1  31.27,36.99 0 top
Y2  23.02,46.1 0 top

### Tracks (layer width: path | path; a pad name or v marks a point on that pad's centre or on a via)
A0  (1 unrouted)
A1  (1 unrouted)
AVDD  (3 unrouted)
CVDD  (2 unrouted)
D9  (1 unrouted)
D10  (1 unrouted)
DTR  (1 unrouted)
DVDD  (11 unrouted)
GBUF  (1 unrouted)
GND  (15 unrouted)
  pour Bottom: 38.1,0 0,0 0,63.5 38.1,63.5
  pour Top: 38.1,0 0,0 0,63.5 38.1,63.5
IO_0  (2 unrouted)
IO_1  (2 unrouted)
IO_2  (2 unrouted)
IO_3  (2 unrouted)
IO_4  (2 unrouted)
IO_6  (1 unrouted)
IO_7  (1 unrouted)
L_AC  (3 unrouted)
LEFT  (2 unrouted)
MISO  (1 unrouted)
MOSI  (1 unrouted)
N$2  (1 unrouted)
N$3  (1 unrouted)
N$6  (1 unrouted)
N$7  (1 unrouted)
N$8  (1 unrouted)
N$15  (1 unrouted)
N$16  (1 unrouted)
N$17  (1 unrouted)
N$19  (1 unrouted)
N$20  (1 unrouted)
N$31  (3 unrouted)
N$35  (via drill 0.38)
  other vias: 3.17,34.92
N$36  (via drill 0.38)
  other vias: 2.86,37.94
N$38  (via drill 0.38)
  other vias: 3.02,40.64
N$39  (1 unrouted)
N$42  (1 unrouted)
N$60  (1 unrouted)
PWRBTN  (2 unrouted)
R_AC  (3 unrouted)
RAW  (5 unrouted)
RIGHT  (2 unrouted)
RXI  (1 unrouted)
SCK  (2 unrouted)
SCL  (1 unrouted)
SCLK  (1 unrouted)
SD3V3  (3 unrouted)
SDA  (1 unrouted)
SDCD  (2 unrouted)
SDCK  (2 unrouted)
SDDI  (2 unrouted)
SDDO  (2 unrouted)
SDXCS  (2 unrouted)
SI  (1 unrouted)
SO  (1 unrouted)
TXO  (1 unrouted)
USBN  (1 unrouted)
USBP  (1 unrouted)
VCC  (14 unrouted)
VS_RX  (2 unrouted)
VS_TX  (1 unrouted)
XCS  (1 unrouted)
XRST  (2 unrouted)
XTAL0  (3 unrouted)
XTAL1  (3 unrouted)

### Text on the board
Bottom: v02
tPlace: A3 | A2 | A1 | A0 | VIN | D13 | GND | D12 | SCL | SDA | D11 | D10 | 3.3 | D9 | GND | D8 | D7 | PAPA / SOUNDIE | Audio Player
bPlace: GND | R | L | D7 | D8 | GND | D9 | ~ | 3.3 | D10 | ~ | MOSI | ~ | GND | MISO | 3.3 | SCK | SDA | SCL | A0 | A1 | LIL' SOUNDIE | GND | A2 | RESET | AUDIO PLAYER | VCC | A3 | 3.6-5.5v
Measures: All Units Inches
tDocu: Mary West